# EasyEDA Pro project ensmartening.eprj

# Schematic ensmartening
Create Date: 2025-07-15; Page Name: SunnyBike; Project Name: ensmartening; Schematic Name: ensmartening; Update Date: 2025-07-15; Page Size: A4; Version: V1.0
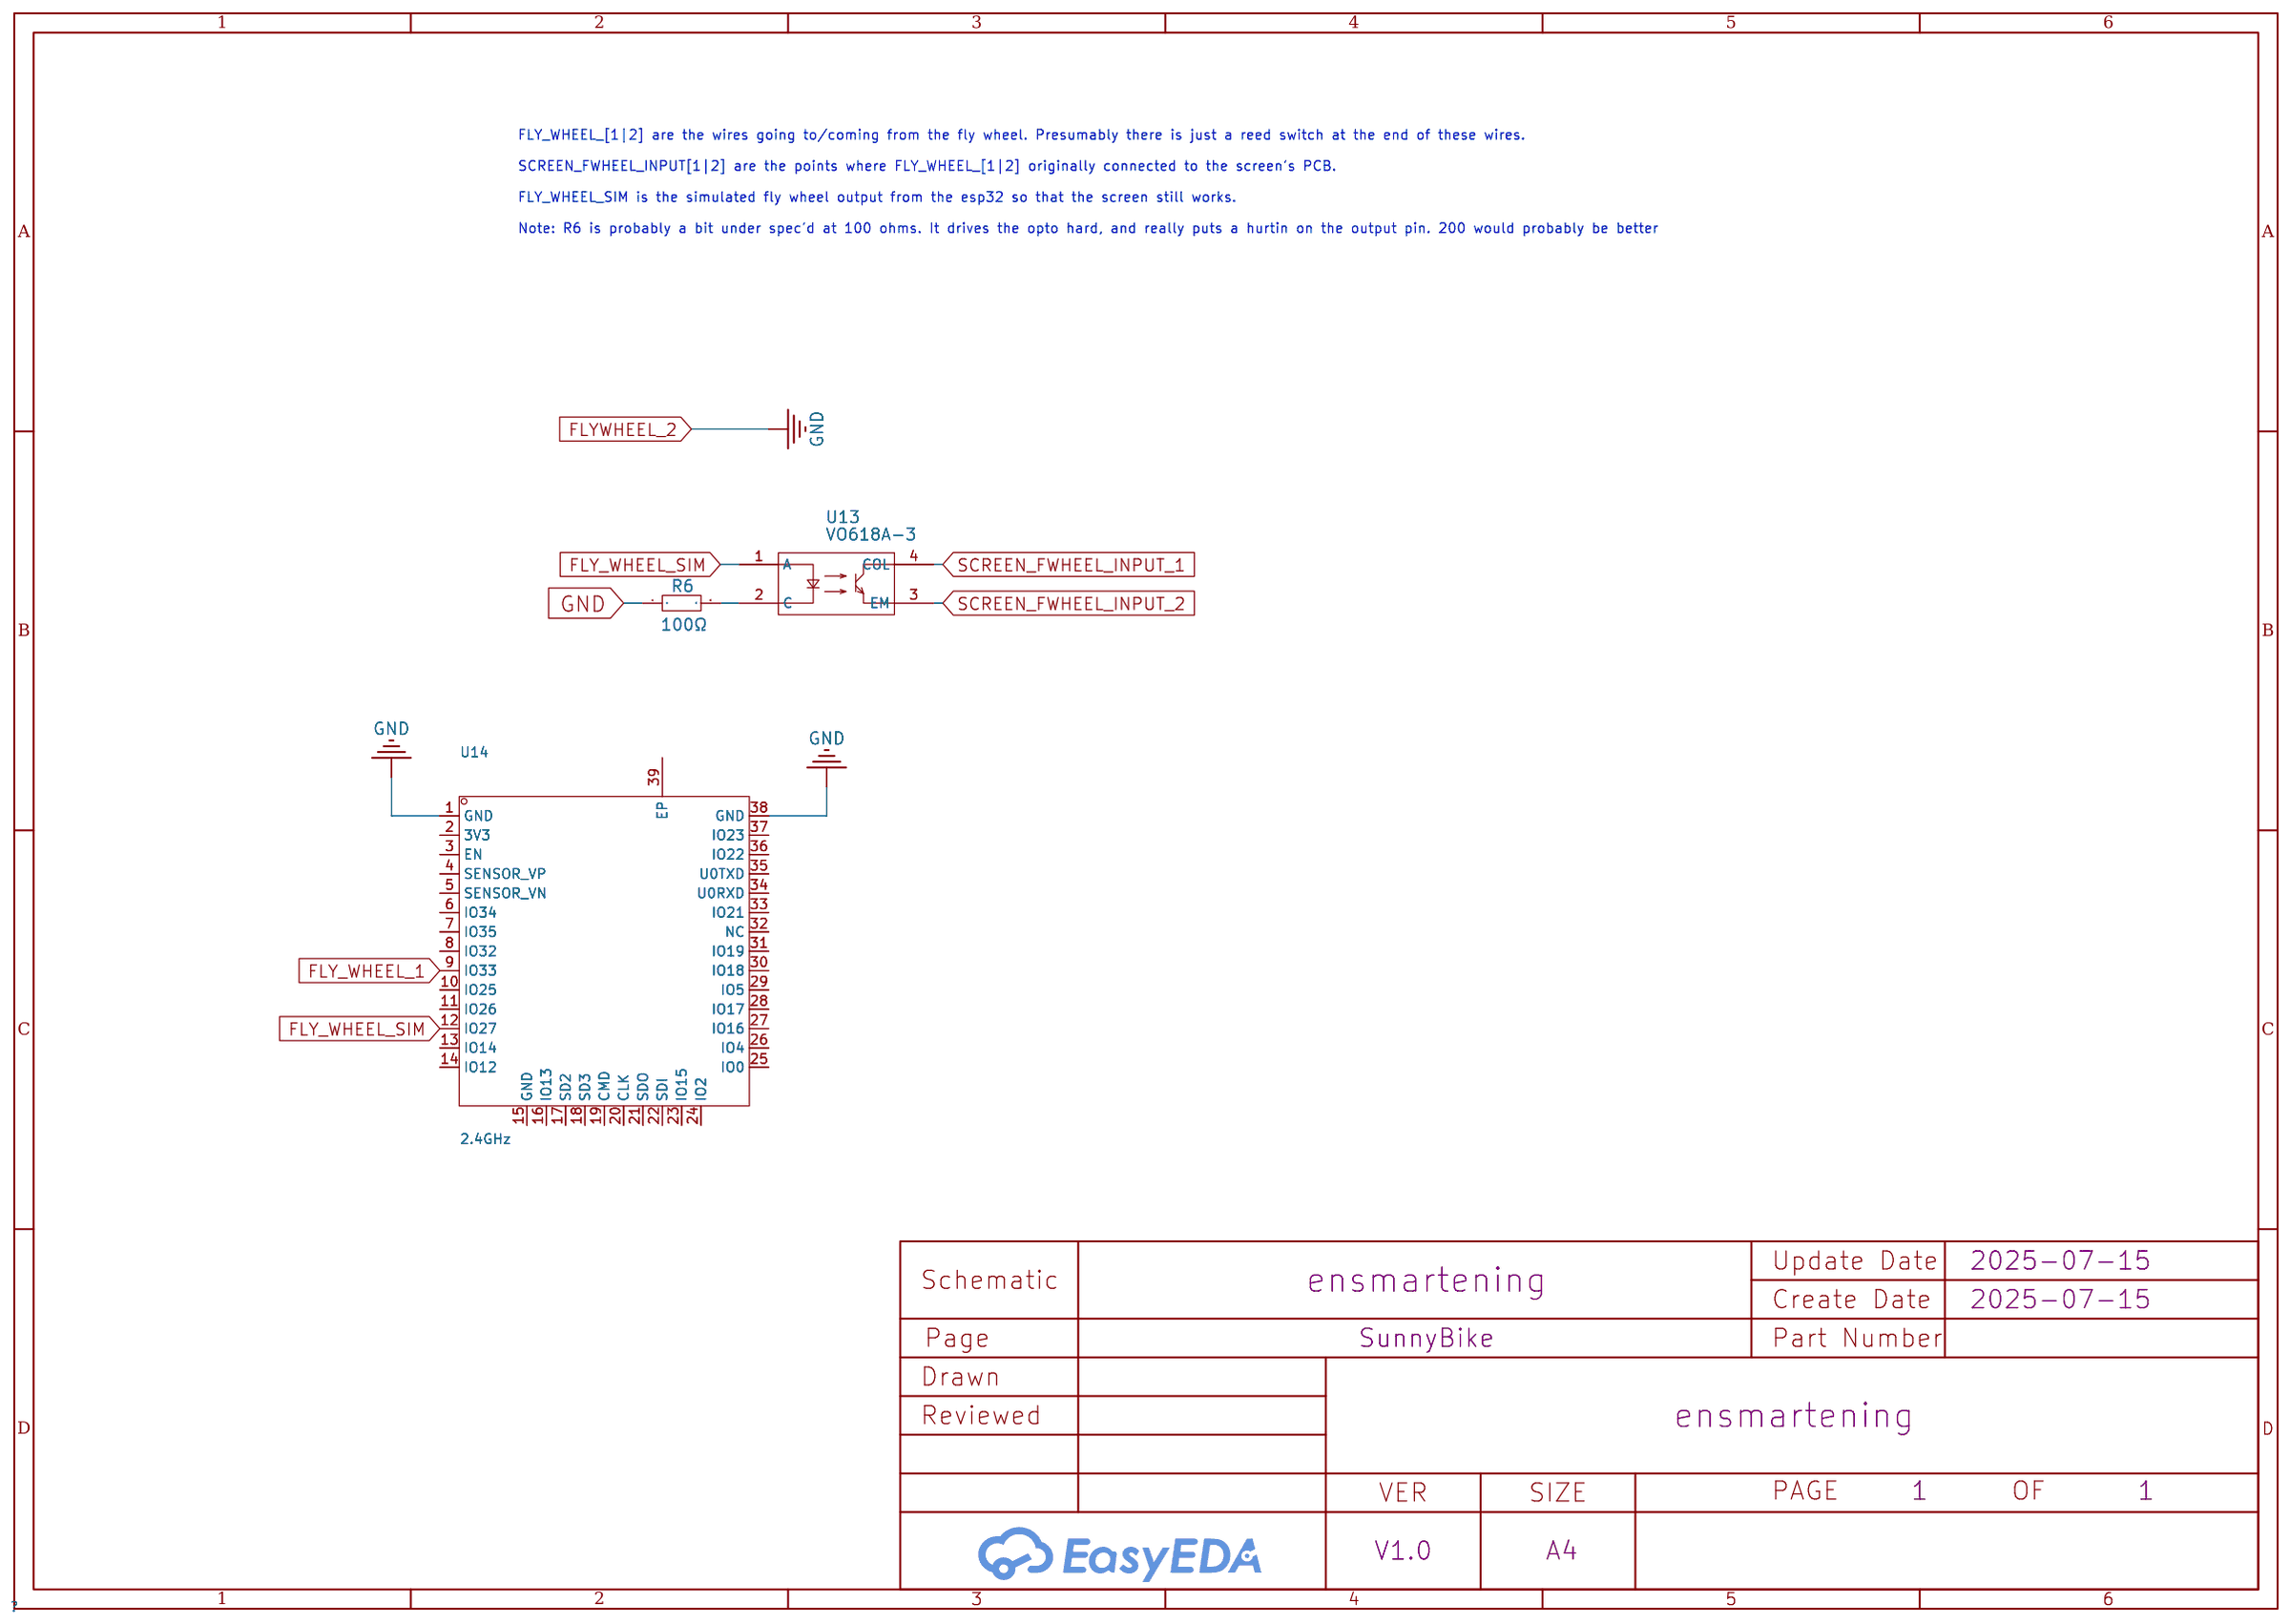
[diagram p0: schematic sheet]

## Parts
R6  100Ω  [R0603]
U13  VO618A-3  [DIP-4_L6.4-W4.6-P2.54-LS7.6-BL]
U14  2.4GHz  [WIRELM-SMD_ESP32-S]

## Library data of the parts
R6 = 100Ω: Supplier: LCSC; Manufacturer: YAGEO(国巨); Manufacturer Part: RC0603JR-07100RL; Supplier Part: C110091; JLCPCB Part Class: Extended Part
U13 = VO618A-3: Supplier: LCSC; Manufacturer: VISHAY(威世); Supplier Part: C142630; JLCPCB Part Class: ExtendedPart
U14 = ESP32-S: Core Processor:ESP32芯片 Wireless Standard:- Support Interface:I2C；UART；DAC；SPI；PWM；ADC Frequency:2.4GHz Antenna Type:IPEX接口 Output Power:17dBm Output Power:17dBm Operating Voltage:3.3V Operating Voltage:3.3V Receive  Current:- Send  Current:- Sensitivity:-; Supplier Part: C277944; Manufacturer: Ai-Thinker(安信可); Supplier Footprint: SMD; JLCPCB Part Class: Extended Part; Datasheet: https://atta.szlcsc.com/upload/public/pdf/source/20211217/F4BEA33E732D6002D10DAED85BBCB52B.pdf; Supplier: LCSC; Core Processor: ESP32芯片; Support Interface: I2C；UART；DAC；SPI；PWM；ADC; Antenna Type: IPEX接口; Output Power: 17dBm; Operating Voltage: 3.3V; Sensitivity: -90dBm; Operating Temperature: -40℃~+85℃

## Nets
GND: R6.1 U14.1(GND) U14.38(GND)
FLY_WHEEL_SIM: U13.1(A) U14.12(IO27)
FLYWHEEL_1: U14.9(IO33)
NET2: U13.4(COL)
NET3: U13.3(EM)
Net-(R6-2): R6.2 U13.2(C)

Not connected (* = marked no-connect by the designer): U14 2(3V3) 3(EN) 4(SENSOR_VP) 5(SENSOR_VN) 6(IO34) 7(IO35) 8(IO32) 10(IO25) 11(IO26) 13(IO14) 14(IO12) 15(GND) 16(IO13) 17(SD2) 18(SD3) 19(CMD) 20(CLK) 21(SDO) 22(SDI) 23(IO15) 24(IO2) 25(IO0) 26(IO4) 27(IO16) 28(IO17) 29(IO5) 30(IO18) 31(IO19) 32(NC) 33(IO21) 34(U0RXD) 35(U0TXD) 36(IO22) 37(IO23) 39(EP)

## Notes on the sheet
- FLY_WHEEL_[1|2] are the wires going to/coming from the fly wheel. Presumably there is just a reed switch at the end of these wires.
  SCREEN_FWHEEL_INPUT[1|2] are the points where FLY_WHEEL_[1|2] originally connected to the screen's PCB.
  FLY_WHEEL_SIM is the simulated fly wheel output from the esp32 so that the screen still works.
  Note: R6 is probably a bit under spec'd at 100 ohms. It drives the opto hard, and really puts a hurtin on the output pin. 200 would probably be better
